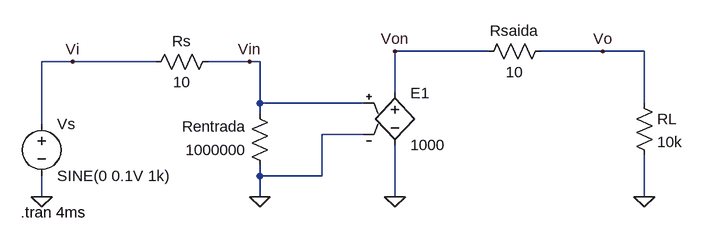
[diagram p0: schematic parte2.asc]
parte2.asc, the LTspice schematic file:
Version 4
SHEET 1 972 680
WIRE 640 64 496 64
WIRE 816 64 720 64
WIRE 880 64 816 64
WIRE 0 80 -48 80
WIRE 128 80 0 80
WIRE 272 80 208 80
WIRE 288 80 272 80
WIRE 496 128 496 64
WIRE 288 144 288 80
WIRE 448 144 288 144
WIRE 880 144 880 64
WIRE 288 160 288 144
WIRE -48 176 -48 80
WIRE 448 192 384 192
WIRE 288 256 288 240
WIRE 384 256 384 192
WIRE 384 256 288 256
WIRE -48 288 -48 256
WIRE 288 288 288 256
WIRE 496 288 496 208
WIRE 880 288 880 224
FLAG -48 288 0
FLAG 288 288 0
FLAG 496 288 0
FLAG 880 288 0
FLAG 816 64 Vo
FLAG 0 80 Vi
FLAG 272 80 Vin
FLAG 496 64 Von
SYMBOL voltage -48 160 R0
WINDOW 123 0 0 Left 2
WINDOW 39 0 0 Left 2
SYMATTR InstName Vs
SYMATTR Value SINE(0 0.1V 1k)
SYMBOL res 224 64 R90
WINDOW 0 0 56 VBottom 2
WINDOW 3 32 56 VTop 2
SYMATTR InstName Rs
SYMATTR Value 10
SYMBOL res 304 256 R180
WINDOW 0 36 76 Left 2
WINDOW 3 36 40 Left 2
SYMATTR InstName Rentrada
SYMATTR Value 1000000
SYMBOL res 736 48 R90
WINDOW 0 0 56 VBottom 2
WINDOW 3 32 56 VTop 2
SYMATTR InstName Rsaida
SYMATTR Value 10
SYMBOL res 864 128 R0
SYMATTR InstName RL
SYMATTR Value 10k
SYMBOL e 496 112 R0
SYMATTR InstName E1
SYMATTR Value 1000
TEXT -80 312 Left 2 !.tran 4ms

The netlist it stands for:
* parte2.asc
Vs Vi 0 SINE(0 0.1V 1k)
Rs Vin Vi 10
Rentrada 0 Vin 1000000
Rsaida Vo Von 10
RL Vo 0 10k
E1 Von 0 Vin 0 1000
.tran 4ms
.backanno
.end

* Results of the author's LTspice run, read from the files saved beside the schematic
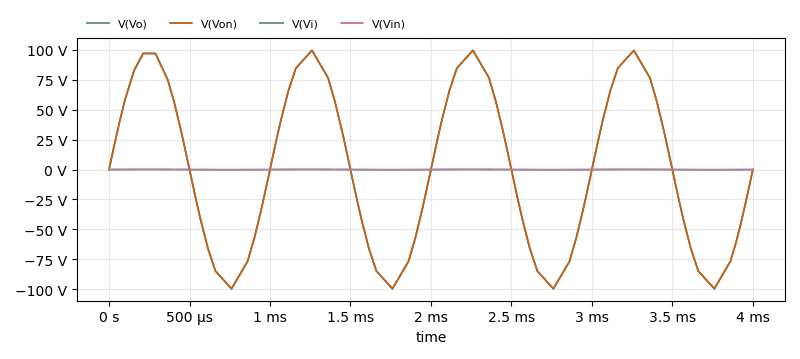
[diagram p1: Transient Analysis of parte2.asc, plotted from the saved traces]
* Transient Analysis, 1 run:
*   V(Vo): min -99.56 V, max 99.56 V, average 68.74 mV, rms 69.39 V, last 0 V
*   V(Von): min -99.66 V, max 99.66 V, average 68.8 mV, rms 69.46 V, last 0 V
*   V(Vi): min -99.66 mV, max 99.66 mV, average 68.81 µV, rms 69.46 mV, last 0 V
*   V(Vin): min -99.66 mV, max 99.66 mV, average 68.8 µV, rms 69.46 mV, last 0 V